# EasyEDA Pro project Argo_v2_Project.epro

# Schematic Mainboard
Board Name: Mainboard; Create Date: 2025-08-30; Page Name: CM4/5 Connector; Project Name: Argo-v2; Schematic Name: Mainboard; Update Date: 2025-09-11; Company: EasyEDA.com; Page Size: A4; Version: V1.0
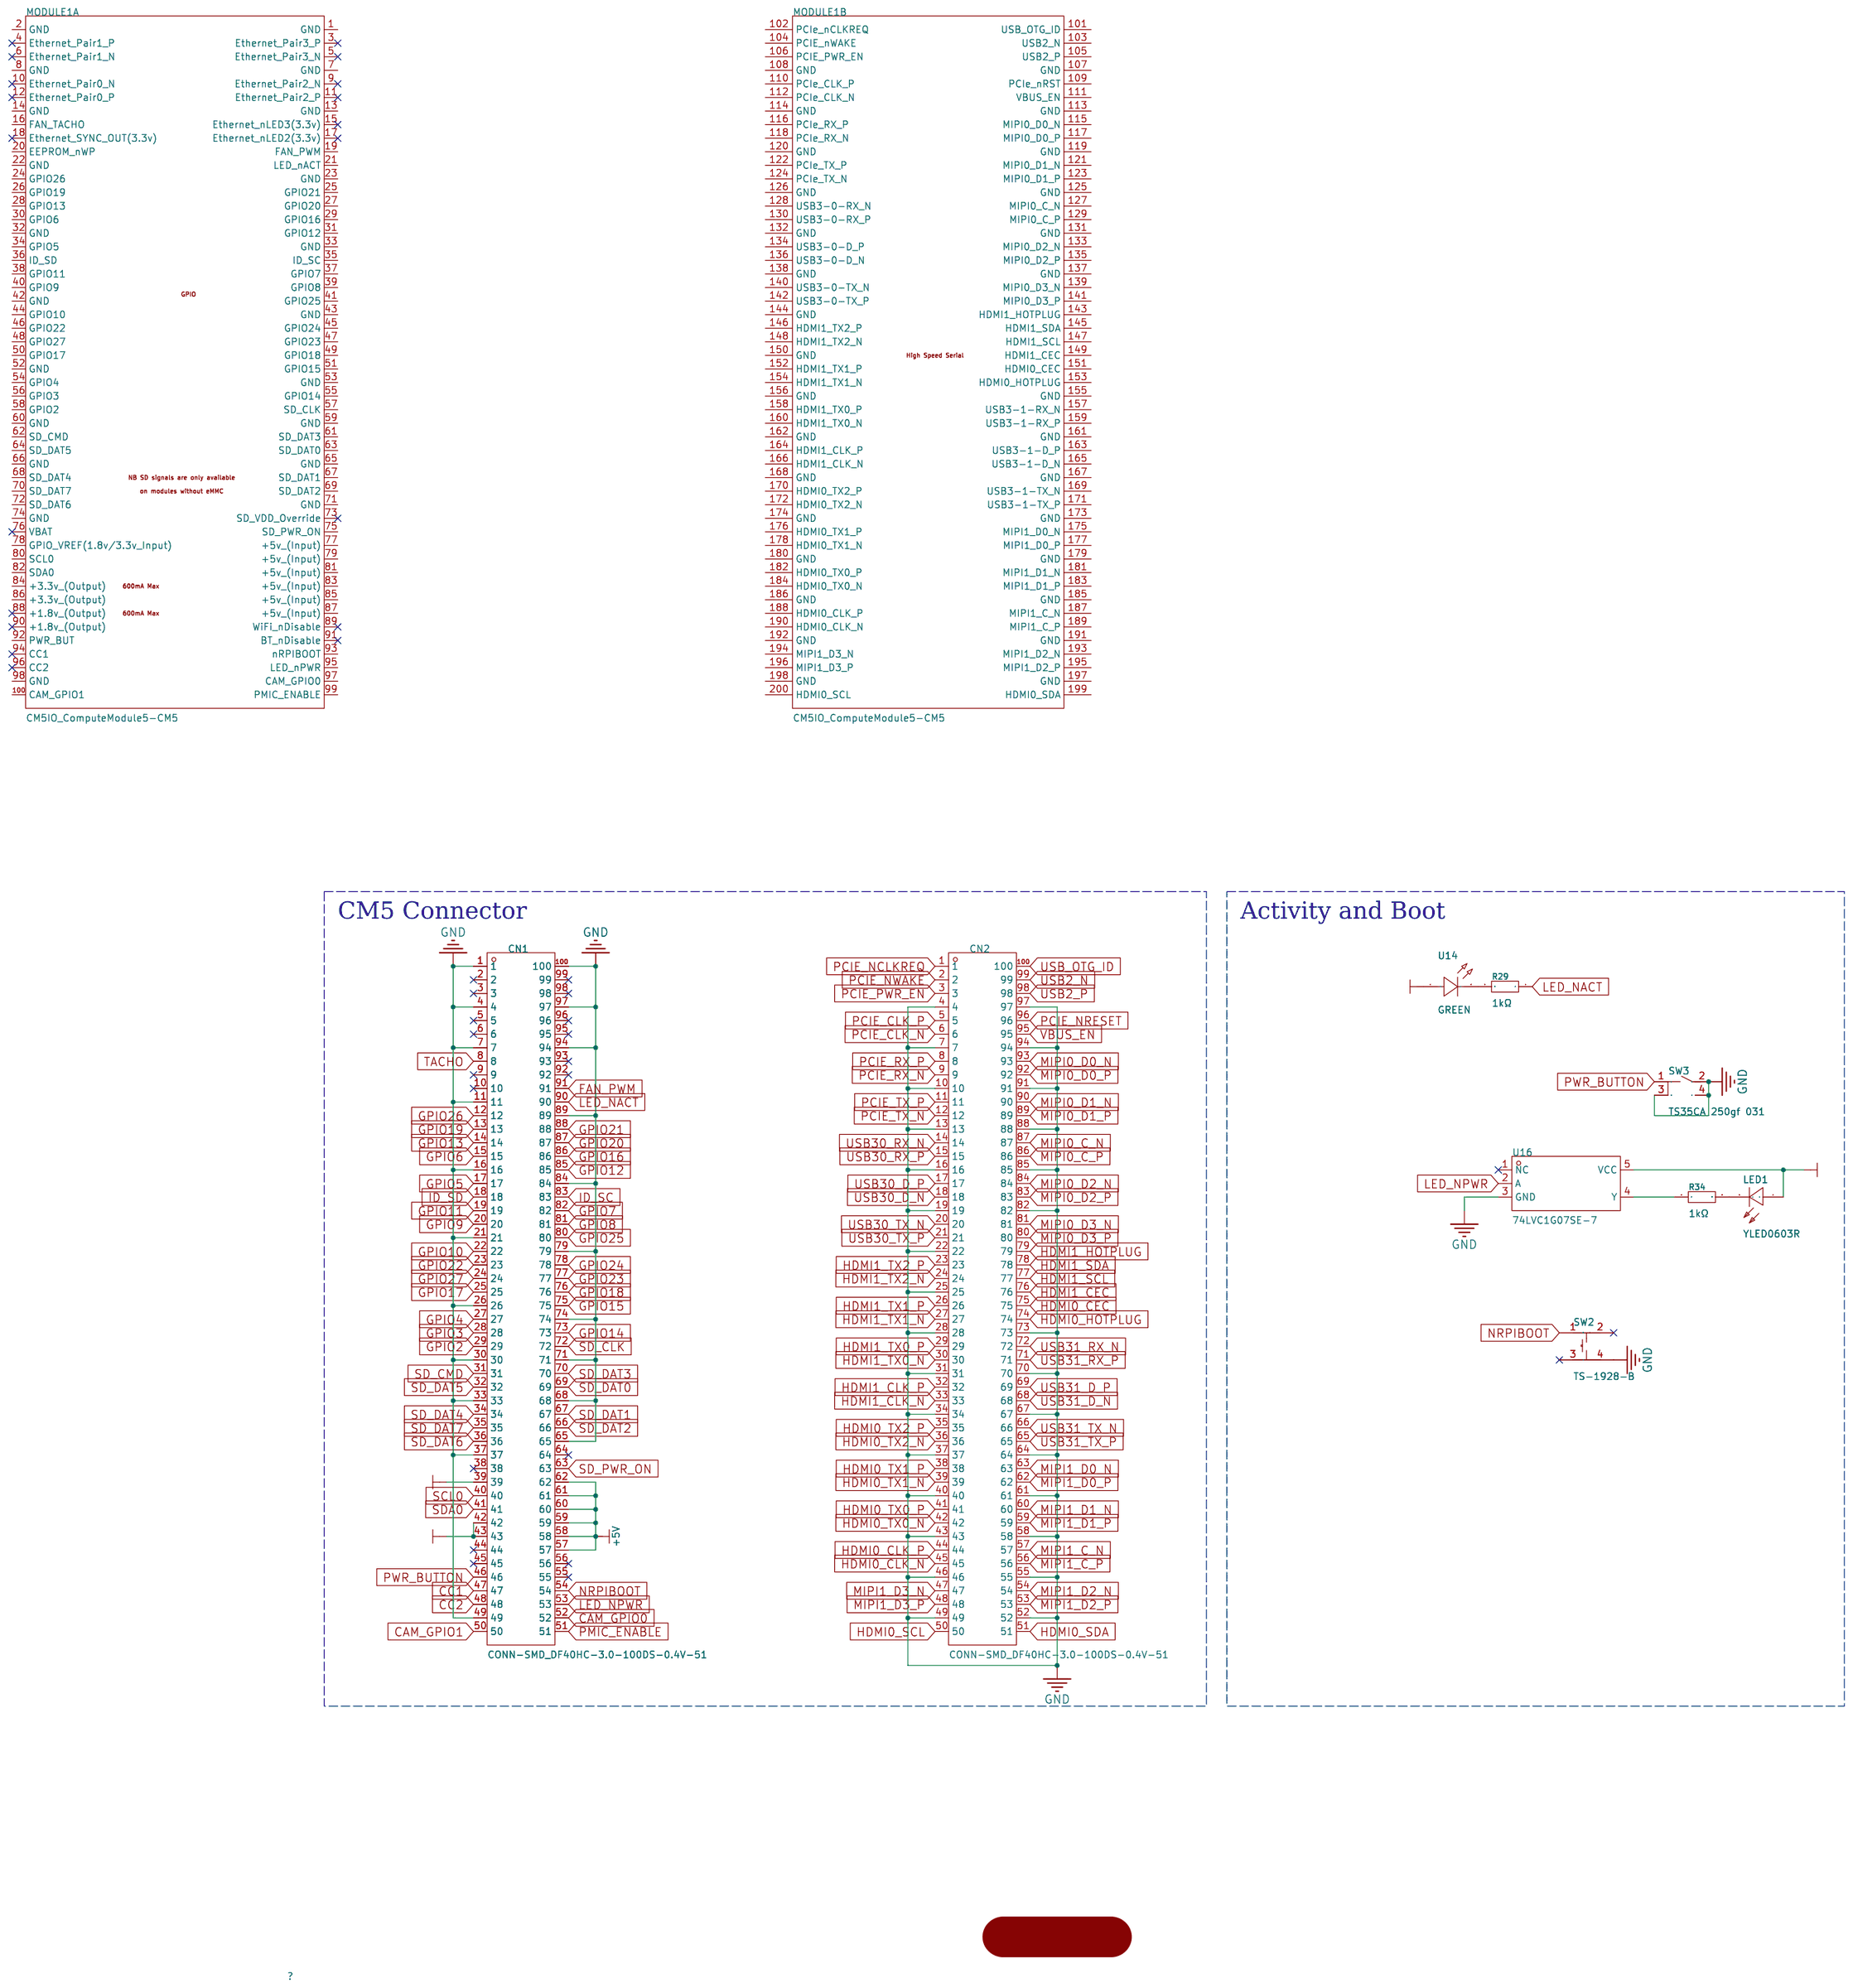
[diagram p0: schematic sheet]

## Parts
CN1  CONN-SMD_DF40HC-3.0-100DS-0.4V-51  [CONN-SMD_DF40HC-3.0-100DS-0.4V-51]
CN2  CONN-SMD_DF40HC-3.0-100DS-0.4V-51  [CONN-SMD_DF40HC-3.0-100DS-0.4V-51]
LED1  YLED0603R  [LED0603-FD]
MODULE1  ComputeModule5-CM5  [CM5IO:Raspberry-Pi-5-Compute-Module]  (sections 1,2)  (no BOM)
R29  1kΩ  [R0402]
R34  1kΩ  [R0402]
SW2  TS-1928-B  [KEY-SMD_4P-L2.8-W2.0-P1.20-LS3.0-TL]
SW3  TS35CA 250gf 031  [KEY-SMD_TS35CA-100GF-031]
U14  GREEN  [LED0603-FD]
U16  74LVC1G07SE-7  [SC-88A_L2.0-W1.3-P0.65-LS2.1-BL]

## Library data of the parts
CN1 CN2 = DF40HC(3.0)-100DS-0.4V(51): Number of Pins:- Pitch:0.4mm Gender:Female Mounting Style:Brick nogging Number of Rows:2 Current Rating (Max):300mA Contact Plating:Gold Operating Temperature Range:-35℃~+85℃ Operating Temperature Range:-35℃~+85℃; LCSC Part Name: 间距:0.4mm 母 立贴; Supplier Part: C424649; Manufacturer: HRS(广濑); Supplier Footprint: SMD,P=0.4mm; JLCPCB Part Class: Extended Part; Datasheet: https://atta.szlcsc.com/upload/public/pdf/source/20190903/C424648_4BEB475664B3701E3114D0DD20EED667.pdf; Supplier: LCSC; Pitch: 0.4mm; Gender: Female; Mounting Style: Brick nogging; Number of Rows: 2; Current Rating (Max): 300mA; Contact Plating: Gold; Operating Temperature Range: -35℃~+85℃
LED1 = YLED0603R: Emitted Color:Red Forward Voltage (VF):1.8V~2.4V Forward Voltage (VF):1.8V~2.4V Power Dissipation:- Forward Current:25mA Dominant Wavelength:620nm~625nm Dominant Wavelength:620nm~625nm Peak Wavelength:- Diode Configuration:- Lens Color:- Color Temperature; Supplier Part: C19171390; Manufacturer: YONGYUTAI(永裕泰); Supplier Footprint: 0603; JLCPCB Part Class: Extended Part; Datasheet: https://atta.szlcsc.com/upload/public/pdf/source/20231027/FB19AF06E2C70028E58AB5CEDD1BDC72.pdf; Supplier: LCSC; Emitted Color: Red; Forward Voltage (VF): 1.8V~2.4V; Forward Current: 25mA; Dominant Wavelength: 620nm~625nm; Operating Temperature: -40℃~+85℃
MODULE1 = CM5IO_ComputeModule5-CM5: Field4: Amphenol; Field5: 2x 10164227-1001A1RLF; Field6: 2x 10164227-1001A1RLF; Field7: Hirose; Part Description: 100 Position Connector Receptacle, Center Strip Contacts Surface Mount Gold
R29 R34 = 0402WGF1001TCE: Type:Thick Film Resistors Resistance:1kΩ Tolerance:±1% Tolerance:±1% Power(Watts): Overload Voltage (Max): Temperature Coefficient:±100ppm/℃ Temperature Coefficient:±100ppm/℃ Operating Temperature Range:-55℃~+155℃ Operating Temperature Range:-55℃~+155℃; LCSC Part Name: 1kΩ ±1% 62.5mW 厚膜电阻; Supplier Part: C11702; Manufacturer: UNI-ROYAL(厚声); Supplier Footprint: 0402; JLCPCB Part Class: Basic Part; Datasheet: https://atta.szlcsc.com/upload/public/pdf/source/20200306/C422600_1E6D84923E4A46A82E41ADD87F860B5C.pdf; Supplier: LCSC; Type: Thick Film Resistors; Tolerance: ±1%; Temperature Coefficient: ±100ppm/℃; Operating Temperature Range: -55℃~+155℃
SW2 = TS-1928-B: Circuit:SPST Actuator Style:Round Button Operating Force:160gf Mounting Style:Brick nogging Switch Length:1.95mm Switch Width:2.8mm Switch Height:0.6mm Strike Gundam:不带 Contact Current:50mA Voltage Rating (DC):12V Insulation Resistance:- Actuator/Cap Colo; LCSC Part Name: 1.95*2.8*0.6mm 立贴 轻触开关; Supplier Part: C1121891; Manufacturer: XKB Connectivity(中国星坤); Supplier Footprint: SMD; JLCPCB Part Class: Extended Part; Datasheet: https://atta.szlcsc.com/upload/public/pdf/source/20211011/D4E0D57631292A8298BD84F341C06C74.pdf; Supplier: LCSC; Circuit: SPST; Actuator Style: Round Button; Operating Force: 160gf; Mounting Style: Brick nogging; Switch Length: 1.95mm; Switch Width: 2.8mm; Switch Height: 0.6mm; Strike Gundam: 不带; Contact Current: 50mA; Voltage Rating (DC): 12V; Actuator/Cap Color: Black; With Lamp: No; Mechanical Life: 30万次; Operating Temperature: -30℃~+85℃
SW3 = TS35CA 250gf 031: Circuit:SPST Actuator Style:Round Button Operating Force:2.5N Mounting Type:Surface Mount, Right Angle Length:4.5mm Width:3.4mm Switch Height:5mm with Bracket:Without Bracket Contact Current:50mA Voltage Rating:12V Actuator/Cap Color:- With Lamp:No IP Rat; LCSC Part Name: 3*5/3x5 轻触开关; Supplier Part: C39832523; Manufacturer: SHOU HAN(首韩); Supplier Footprint: SMD-5P,4.5x3.4mm; JLCPCB Part Class: Extended Part; Datasheet: https://item.szlcsc.com/datasheet/TS35CA%2520250gf%2520031/41559920.html; Supplier: LCSC; Circuit: SPST; Actuator Style: Round Button; Operating Force: 2.5N; Mounting Type: Surface Mount, Right Angle; Length: 4.5mm; Width: 3.4mm; Switch Height: 5mm; with Bracket: Without Bracket; Contact Current: 50mA; Voltage Rating: 12V; With Lamp: No; Life: 100,000 Cycles
U14 = YLED0603G: Emitted Color:Emerald Forward Voltage (VF):2.7V~3.2V Forward Voltage (VF):2.7V~3.2V Power Dissipation:- Forward Current:25mA Dominant Wavelength:510nm~531nm Dominant Wavelength:510nm~531nm Peak Wavelength:- Diode Configuration:- Lens Color:- Color Tempera; Supplier Part: C19273151; Manufacturer: YONGYUTAI(永裕泰); Supplier Footprint: 0603; JLCPCB Part Class: Extended Part; Datasheet: https://atta.szlcsc.com/upload/public/pdf/source/20231201/6896CD173B7817C61CFF421DECB2B9C4.pdf; Supplier: LCSC; Emitted Color: Emerald; Forward Voltage (VF): 2.7V~3.2V; Forward Current: 25mA; Dominant Wavelength: 510nm~531nm; Operating Temperature: -40℃~+85℃
U16 = 74LVC1G07SE-7: Input type:- output type:Open Drain Voltage - Supply:1.65V~5.5V Voltage - Supply:1.65V~5.5V Number of Elements:1 Number of Bits per Element:1 Current - Output Low(IOL):32mA Current - Output High(IOH):- Logic Family:74LVC Operating Temperature:-40℃~+125℃ O; Supplier Part: C67531; Manufacturer: DIODES(美台); Supplier Footprint: SOT-353; JLCPCB Part Class: Extended Part; Datasheet: https://atta.szlcsc.com/upload/public/pdf/source/20221028/74AA45ACBD17A35958964086DB04CD39.pdf; Supplier: LCSC; output type: Open Drain; Voltage - Supply: 1.65V~5.5V; Number of Elements: 1; Number of Bits per Element: 1; Current - Output Low(IOL): 32mA; Logic Family: 74LVC; Operating Temperature: -40℃~+125℃

## Nets
+3V3: CN1.39 CN1.42 CN1.43 LED1.1(+) U14.1(+) U16.5(VCC)
+5V: CN1.57 CN1.58 CN1.59 CN1.60 CN1.61 CN1.62
GND: CN1.1 CN1.4 CN1.7 CN1.11 CN1.16 CN1.21 CN1.26 CN1.30 CN1.33 CN1.37 CN1.49 CN1.65 CN1.68 CN1.71 CN1.74 CN1.79 CN1.84 CN1.89 CN1.94 CN1.97 CN1.100 CN2.4 CN2.7 CN2.10 CN2.13 CN2.16 CN2.19 CN2.22 CN2.25 CN2.28 CN2.31 CN2.34 CN2.37 CN2.40 CN2.43 CN2.46 CN2.49 CN2.52 CN2.55 CN2.58 CN2.61 CN2.64 CN2.67 CN2.70 CN2.73 CN2.82 CN2.85 CN2.88 CN2.91 CN2.94 CN2.97 SW2.4 SW3.2 SW3.3 SW3.4 U16.3(GND)
VBUS_EN: CN2.95
CAM_GPIO0: CN1.52
CAM_GPIO1: CN1.50
CC1: CN1.47
CC2: CN1.48
FAN_PWM: CN1.91
GPIO2: CN1.29
GPIO3: CN1.28
GPIO4: CN1.27
GPIO5: CN1.17
GPIO6: CN1.15
GPIO7: CN1.82
GPIO8: CN1.81
GPIO9: CN1.20
GPIO10: CN1.22
GPIO11: CN1.19
GPIO12: CN1.85
GPIO13: CN1.14
GPIO14: CN1.73
GPIO15: CN1.75
GPIO16: CN1.86
GPIO17: CN1.25
GPIO18: CN1.76
GPIO19: CN1.13
GPIO20: CN1.87
GPIO21: CN1.88
GPIO22: CN1.23
GPIO23: CN1.77
GPIO24: CN1.78
GPIO25: CN1.80
GPIO26: CN1.12
GPIO27: CN1.24
HDMI0_CEC: CN2.75
HDMI0_CLK_N: CN2.45
HDMI0_CLK_P: CN2.44
HDMI0_HOTPLUG: CN2.74
HDMI0_SCL: CN2.50
HDMI0_SDA: CN2.51
HDMI0_TX0_N: CN2.42
HDMI0_TX0_P: CN2.41
HDMI0_TX1_N: CN2.39
HDMI0_TX1_P: CN2.38
HDMI0_TX2_N: CN2.36
HDMI0_TX2_P: CN2.35
HDMI1_CEC: CN2.76
HDMI1_CLK_N: CN2.33
HDMI1_CLK_P: CN2.32
HDMI1_HOTPLUG: CN2.79
HDMI1_SCL: CN2.77
HDMI1_SDA: CN2.78
HDMI1_TX0_N: CN2.30
HDMI1_TX0_P: CN2.29
HDMI1_TX1_N: CN2.27
HDMI1_TX1_P: CN2.26
HDMI1_TX2_N: CN2.24
HDMI1_TX2_P: CN2.23
ID_SC: CN1.83
ID_SD: CN1.18
LED_NACT: CN1.90 R29.1
LED_NPWR: CN1.53 U16.2(A)
MIPI0_C_N: CN2.87
MIPI0_C_P: CN2.86
MIPI0_D0_N: CN2.93
MIPI0_D0_P: CN2.92
MIPI0_D1_N: CN2.90
MIPI0_D1_P: CN2.89
MIPI0_D2_N: CN2.84
MIPI0_D2_P: CN2.83
MIPI0_D3_N: CN2.81
MIPI0_D3_P: CN2.80
MIPI1_C_N: CN2.57
MIPI1_C_P: CN2.56
MIPI1_D0_N: CN2.63
MIPI1_D0_P: CN2.62
MIPI1_D1_N: CN2.60
MIPI1_D1_P: CN2.59
MIPI1_D2_N: CN2.54
MIPI1_D2_P: CN2.53
MIPI1_D3_N: CN2.47
MIPI1_D3_P: CN2.48
NRPIBOOT: CN1.54 SW2.1
PCIE_CLK_N: CN2.6
PCIE_CLK_P: CN2.5
PCIE_NCLKREQ: CN2.1
PCIE_NRESET: CN2.96
PCIE_NWAKE: CN2.2
PCIE_PWR_EN: CN2.3
PCIE_RX_N: CN2.9
PCIE_RX_P: CN2.8
PCIE_TX_N: CN2.12
PCIE_TX_P: CN2.11
PMIC_ENABLE: CN1.51
PWR_BUTTON: CN1.46 SW3.1
SCL0: CN1.40
SD_CLK: CN1.72
SD_CMD: CN1.31
SD_DAT0: CN1.69
SD_DAT1: CN1.67
SD_DAT2: CN1.66
SD_DAT3: CN1.70
SD_DAT4: CN1.34
SD_DAT5: CN1.32
SD_DAT6: CN1.36
SD_DAT7: CN1.35
SD_PWR_ON: CN1.63
SDA0: CN1.41
TACHO: CN1.8
USB2_N: CN2.99
USB2_P: CN2.98
USB30_D_N: CN2.18
USB30_D_P: CN2.17
USB30_RX_N: CN2.14
USB30_RX_P: CN2.15
USB30_TX_N: CN2.20
USB30_TX_P: CN2.21
USB31_D_N: CN2.68
USB31_D_P: CN2.69
USB31_RX_N: CN2.72
USB31_RX_P: CN2.71
USB31_TX_N: CN2.66
USB31_TX_P: CN2.65
USB_OTG_ID: CN2.100
Net-(LED1-2): LED1.2(-) R34.2
Net-(R29-2): R29.2 U14.2(-)
Net-(R34-1): R34.1 U16.4(Y)

Not connected (* = marked no-connect by the designer): CN1 2* 3* 5* 6* 9* 10* 38* 44* 45* 55* 56* 64* 92* 93* 95* 96* 98* 99*; MODULE1 1(GND) 2(GND) 3(Ethernet_Pair3_P)* 4(Ethernet_Pair1_P)* 5(Ethernet_Pair3_N)* 6(Ethernet_Pair1_N)* 7(GND) 8(GND) 9(Ethernet_Pair2_N)* 10(Ethernet_Pair0_N)* 11(Ethernet_Pair2_P)* 12(Ethernet_Pair0_P)* 13(GND) 14(GND) 15(Ethernet_nLED3(3.3v))* 16(FAN_TACHO) 17(Ethernet_nLED2(3.3v))* 18(Ethernet_SYNC_OUT(3.3v))* 19(FAN_PWM) 20(EEPROM_nWP) 21(LED_nACT) 22(GND) 23(GND) 24(GPIO26) 25(GPIO21) 26(GPIO19) 27(GPIO20) 28(GPIO13) 29(GPIO16) 30(GPIO6) 31(GPIO12) 32(GND) 33(GND) 34(GPIO5) 35(ID_SC) 36(ID_SD) 37(GPIO7) 38(GPIO11) 39(GPIO8) 40(GPIO9) 41(GPIO25) 42(GND) 43(GND) 44(GPIO10) 45(GPIO24) 46(GPIO22) 47(GPIO23) 48(GPIO27) 49(GPIO18) 50(GPIO17) 51(GPIO15) 52(GND) 53(GND) 54(GPIO4) 55(GPIO14) 56(GPIO3) 57(SD_CLK) 58(GPIO2) 59(GND) 60(GND) 61(SD_DAT3) 62(SD_CMD) 63(SD_DAT0) 64(SD_DAT5) 65(GND) 66(GND) 67(SD_DAT1) 68(SD_DAT4) 69(SD_DAT2) 70(SD_DAT7) 71(GND) 72(SD_DAT6) 73(SD_VDD_Override)* 74(GND) 75(SD_PWR_ON) 76(VBAT)* 77(+5v_(Input)) 78(GPIO_VREF(1.8v/3.3v_Input)) 79(+5v_(Input)) 80(SCL0) 81(+5v_(Input)) 82(SDA0) 83(+5v_(Input)) 84(+3.3v_(Output)) 85(+5v_(Input)) 86(+3.3v_(Output)) 87(+5v_(Input)) 88(+1.8v_(Output))* 89(WiFi_nDisable)* 90(+1.8v_(Output))* 91(BT_nDisable)* 92(PWR_BUT) 93(nRPIBOOT) 94(CC1)* 95(LED_nPWR) 96(CC2)* 97(CAM_GPIO0) 98(GND) 99(PMIC_ENABLE) 100(CAM_GPIO1) 101(USB_OTG_ID) 102(PCIe_nCLKREQ) 103(USB2_N) 104(PCIE_nWAKE) 105(USB2_P) 106(PCIE_PWR_EN) 107(GND) 108(GND) 109(PCIe_nRST) 110(PCIe_CLK_P) 111(VBUS_EN) 112(PCIe_CLK_N) 113(GND) 114(GND) 115(MIPI0_D0_N) 116(PCIe_RX_P) 117(MIPI0_D0_P) 118(PCIe_RX_N) 119(GND) 120(GND) 121(MIPI0_D1_N) 122(PCIe_TX_P) 123(MIPI0_D1_P) 124(PCIe_TX_N) 125(GND) 126(GND) 127(MIPI0_C_N) 128(USB3-0-RX_N) 129(MIPI0_C_P) 130(USB3-0-RX_P) 131(GND) 132(GND) 133(MIPI0_D2_N) 134(USB3-0-D_P) 135(MIPI0_D2_P) 136(USB3-0-D_N) 137(GND) 138(GND) 139(MIPI0_D3_N) 140(USB3-0-TX_N) 141(MIPI0_D3_P) 142(USB3-0-TX_P) 143(HDMI1_HOTPLUG) 144(GND) 145(HDMI1_SDA) 146(HDMI1_TX2_P) 147(HDMI1_SCL) 148(HDMI1_TX2_N) 149(HDMI1_CEC) 150(GND) 151(HDMI0_CEC) 152(HDMI1_TX1_P) 153(HDMI0_HOTPLUG) 154(HDMI1_TX1_N) 155(GND) 156(GND) 157(USB3-1-RX_N) 158(HDMI1_TX0_P) 159(USB3-1-RX_P) 160(HDMI1_TX0_N) 161(GND) 162(GND) 163(USB3-1-D_P) 164(HDMI1_CLK_P) 165(USB3-1-D_N) 166(HDMI1_CLK_N) 167(GND) 168(GND) 169(USB3-1-TX_N) 170(HDMI0_TX2_P) 171(USB3-1-TX_P) 172(HDMI0_TX2_N) 173(GND) 174(GND) 175(MIPI1_D0_N) 176(HDMI0_TX1_P) 177(MIPI1_D0_P) 178(HDMI0_TX1_N) 179(GND) 180(GND) 181(MIPI1_D1_N) 182(HDMI0_TX0_P) 183(MIPI1_D1_P) 184(HDMI0_TX0_N) 185(GND) 186(GND) 187(MIPI1_C_N) 188(HDMI0_CLK_P) 189(MIPI1_C_P) 190(HDMI0_CLK_N) 191(GND) 192(GND) 193(MIPI1_D2_N) 194(MIPI1_D3_N) 195(MIPI1_D2_P) 196(MIPI1_D3_P) 197(GND) 198(GND) 199(HDMI0_SDA) 200(HDMI0_SCL); SW2 2* 3*; U16 1(NC)*

## Notes on the sheet
- CM5 Connector
- Activity and Boot
